# EAGLE design interro-cpu-board-r2 (EAGLE 5.12)
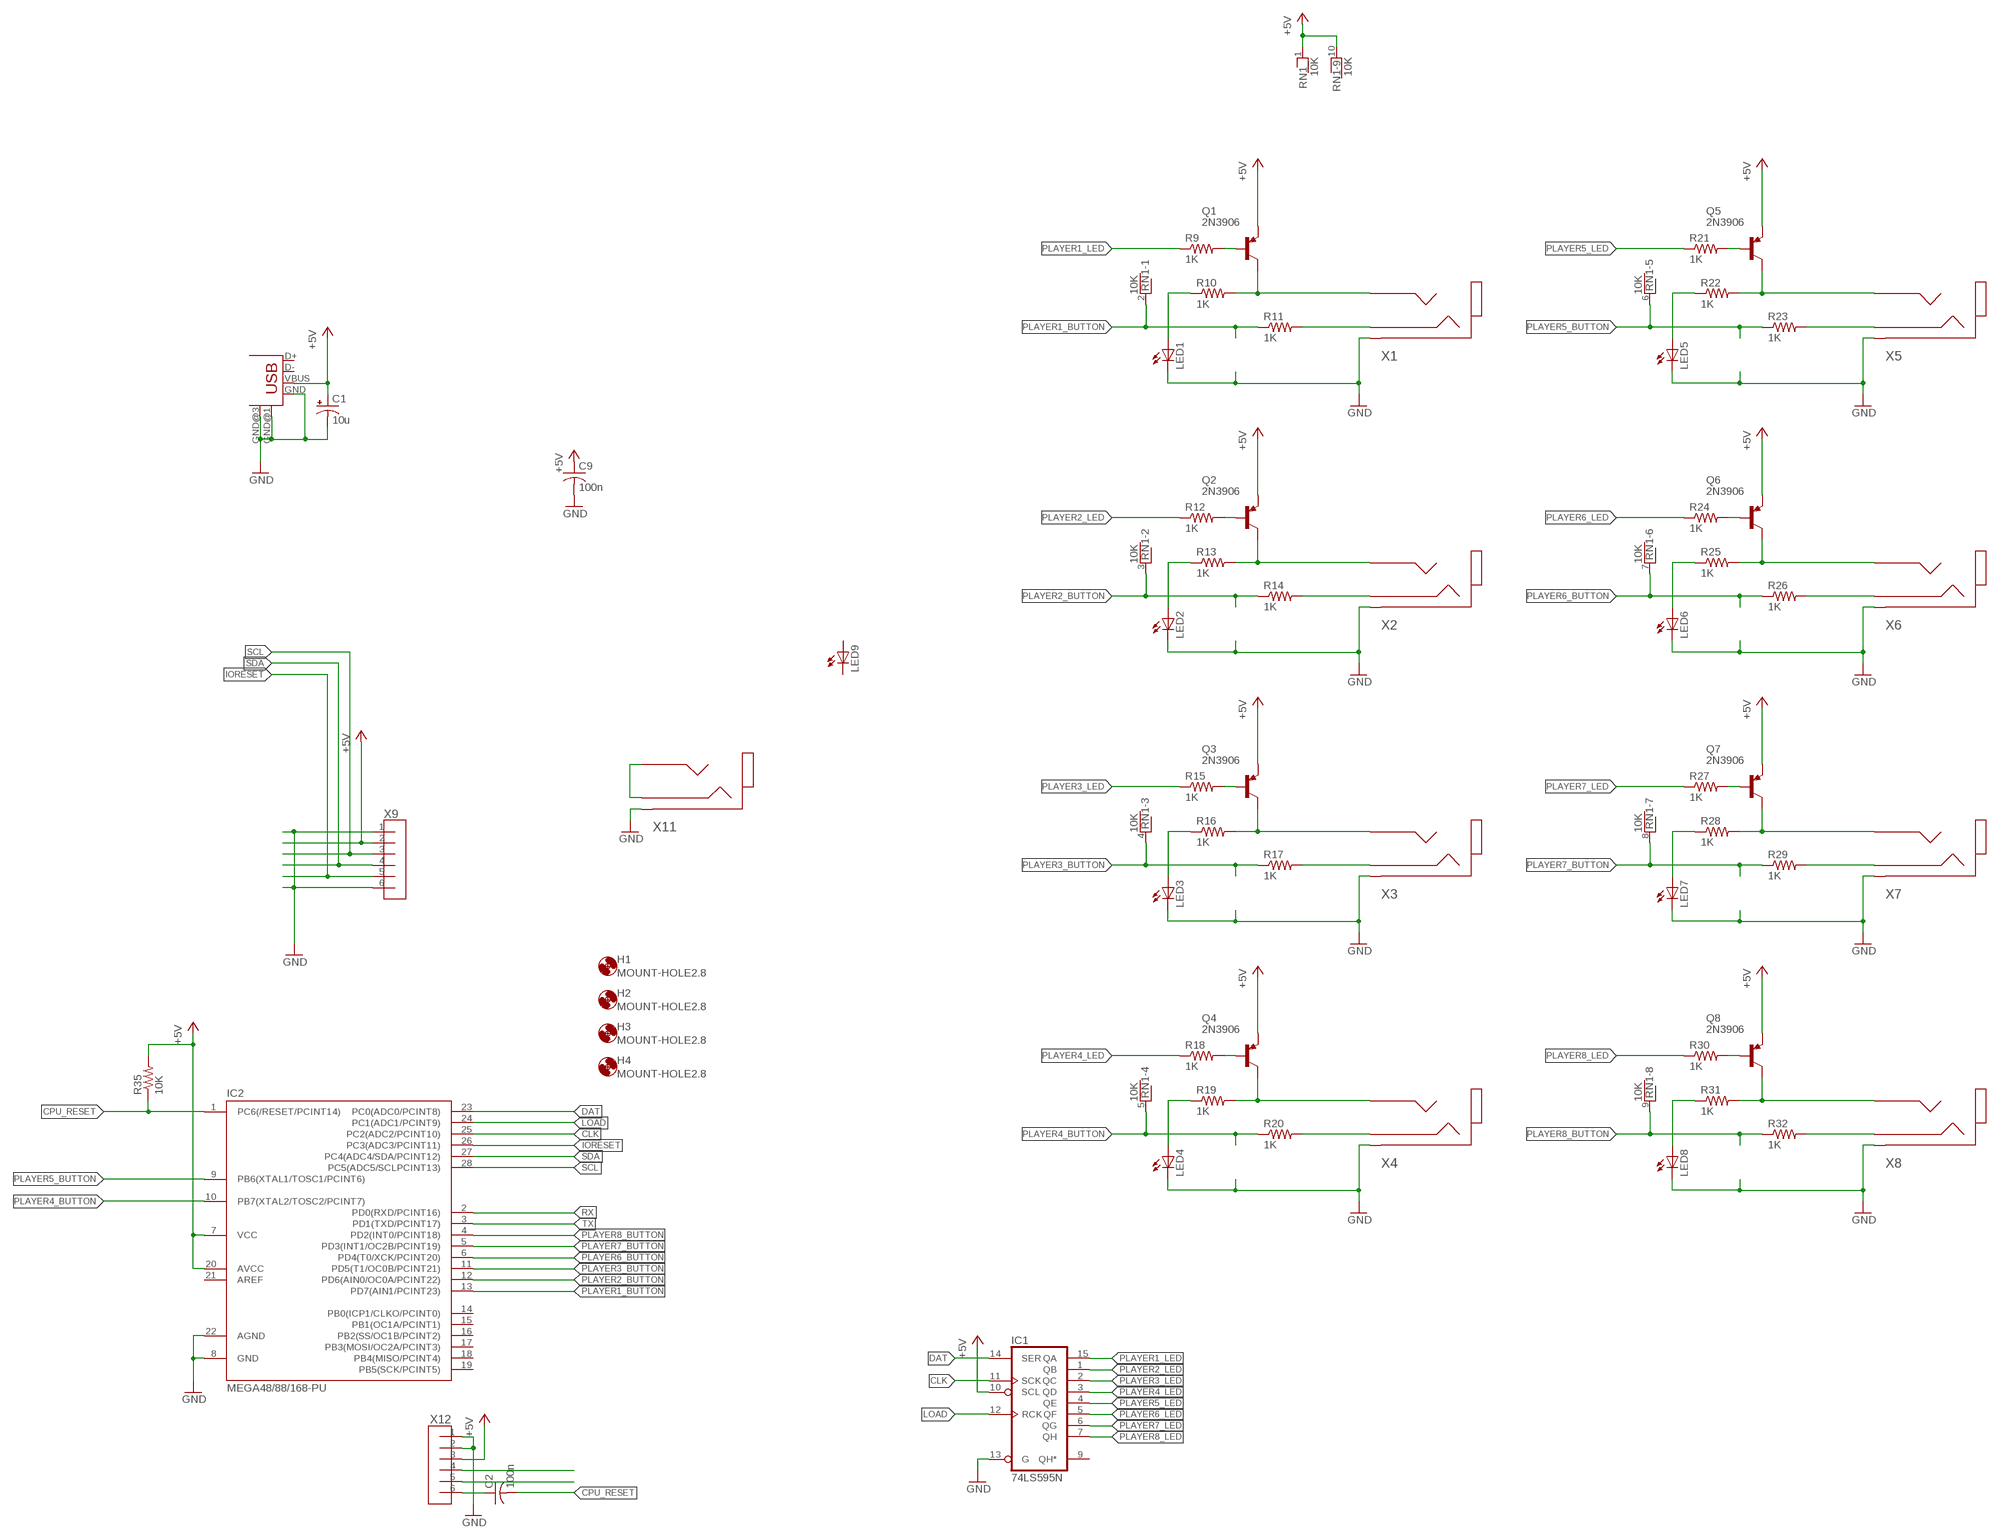
[diagram p0: schematic, sheet 1]

## Parts
C1  10u  CPOL-USE2-5  [E2-5]
C2  100n  C-US050-025X075  [C050-025X075]
C9  100n  C-US050-025X075  [C050-025X075]
H1  MOUNT-HOLE2.8  [2,8]
H2  MOUNT-HOLE2.8  [2,8]
H3  MOUNT-HOLE2.8  [2,8]
H4  MOUNT-HOLE2.8  [2,8]
IC1  74LS595N  [DIL16]
IC2  MEGA48/88/168-PU  [DIL28-3]
LED1  LED3MM  [LED3MM]
LED2  LED3MM  [LED3MM]
LED3  LED3MM  [LED3MM]
LED4  LED3MM  [LED3MM]
LED5  LED3MM  [LED3MM]
LED6  LED3MM  [LED3MM]
LED7  LED3MM  [LED3MM]
LED8  LED3MM  [LED3MM]
LED9  LED3MM  [LED3MM]
Q1  2N3906  [TO92]
Q2  2N3906  [TO92]
Q3  2N3906  [TO92]
Q4  2N3906  [TO92]
Q5  2N3906  [TO92]
Q6  2N3906  [TO92]
Q7  2N3906  [TO92]
Q8  2N3906  [TO92]
R9  1K  R-US_0207/7  [0207/7]
R10  1K  R-US_0207/7  [0207/7]
R11  1K  R-US_0207/7  [0207/7]
R12  1K  R-US_0207/7  [0207/7]
R13  1K  R-US_0207/7  [0207/7]
R14  1K  R-US_0207/7  [0207/7]
R15  1K  R-US_0207/7  [0207/7]
R16  1K  R-US_0207/7  [0207/7]
R17  1K  R-US_0207/7  [0207/7]
R18  1K  R-US_0207/7  [0207/7]
R19  1K  R-US_0207/7  [0207/7]
R20  1K  R-US_0207/7  [0207/7]
R21  1K  R-US_0207/7  [0207/7]
R22  1K  R-US_0207/7  [0207/7]
R23  1K  R-US_0207/7  [0207/7]
R24  1K  R-US_0207/7  [0207/7]
R25  1K  R-US_0207/7  [0207/7]
R26  1K  R-US_0207/7  [0207/7]
R27  1K  R-US_0207/7  [0207/7]
R28  1K  R-US_0207/7  [0207/7]
R29  1K  R-US_0207/7  [0207/7]
R30  1K  R-US_0207/7  [0207/7]
R31  1K  R-US_0207/7  [0207/7]
R32  1K  R-US_0207/7  [0207/7]
R35  10K  R-US_0207/7  [0207/7]
RN1  10K  RNX9  [RN-10]
X1  SJ1-3533N  [SJ1-3533N]
X2  SJ1-3533N  [SJ1-3533N]
X3  SJ1-3533N  [SJ1-3533N]
X4  SJ1-3533N  [SJ1-3533N]
X5  SJ1-3533N  [SJ1-3533N]
X6  SJ1-3533N  [SJ1-3533N]
X7  SJ1-3533N  [SJ1-3533N]
X8  SJ1-3533N  [SJ1-3533N]
X9  M06-100MIL  [100MIL-6]
X10  USB-RAYMOND  [USB-MB-RAYMOND]
X11  SJ1-3533N  [SJ1-3533N]
X12  M06-100MIL  [100MIL-6]

## Nets
+5V: C1.+ C9.1 IC1.10(SCL) IC2.7(VCC) IC2.20(AVCC) Q1.3(E) Q2.3(E) Q3.3(E) Q4.3(E) Q5.3(E) Q6.3(E) Q7.3(E) Q8.3(E) R35.2 RN1.1 RN1.10 X9.2 X10.VBUS X12.3
CLK: IC1.11(SCK) IC2.25(PC2(ADC2/PCINT10))
CPU_RESET: C2.2 IC2.1(PC6(/RESET/PCINT14)) R35.1
DAT: IC1.14(SER) IC2.23(PC0(ADC0/PCINT8))
GND: C1.- C9.2 IC1.13(G) IC2.8(GND) IC2.22(AGND) LED1.K(C) LED2.K(C) LED3.K(C) LED4.K(C) LED5.K(C) LED6.K(C) LED7.K(C) LED8.K(C) X1.SHIELD(SLEEVE) X2.SHIELD(SLEEVE) X3.SHIELD(SLEEVE) X4.SHIELD(SLEEVE) X5.SHIELD(SLEEVE) X6.SHIELD(SLEEVE) X7.SHIELD(SLEEVE) X8.SHIELD(SLEEVE) X9.1 X9.6 X10.GND X10.GND@1(GND) X10.GND@3(GND) X11.SHIELD(SLEEVE) X12.1 X12.2
IORESET: IC2.26(PC3(ADC3/PCINT11)) X9.5
LOAD: IC1.12(RCK) IC2.24(PC1(ADC1/PCINT9))
N$2: X11.RING X11.TIP
N$5: C2.1 X12.6
N$9: R11.2 X1.RING
N$10: Q1.1(C) R10.2 X1.TIP
N$12: Q1.2(B) R9.2
N$13: LED1.A R10.1
N$14: R14.2 X2.RING
N$15: Q2.1(C) R13.2 X2.TIP
N$16: Q2.2(B) R12.2
N$17: LED2.A R13.1
N$18: R17.2 X3.RING
N$19: Q3.1(C) R16.2 X3.TIP
N$20: Q3.2(B) R15.2
N$21: LED3.A R16.1
N$22: R20.2 X4.RING
N$23: Q4.1(C) R19.2 X4.TIP
N$24: Q4.2(B) R18.2
N$25: LED4.A R19.1
N$26: R23.2 X5.RING
N$27: Q5.1(C) R22.2 X5.TIP
N$28: Q5.2(B) R21.2
N$29: LED5.A R22.1
N$30: R26.2 X6.RING
N$31: Q6.1(C) R25.2 X6.TIP
N$32: Q6.2(B) R24.2
N$33: LED6.A R25.1
N$34: R29.2 X7.RING
N$35: Q7.1(C) R28.2 X7.TIP
N$36: Q7.2(B) R27.2
N$37: LED7.A R28.1
N$38: R32.2 X8.RING
N$39: Q8.1(C) R31.2 X8.TIP
N$40: Q8.2(B) R30.2
N$41: LED8.A R31.1
PLAYER1_BUTTON: IC2.13(PD7(AIN1/PCINT23)) R11.1 RN1.2
PLAYER1_LED: IC1.15(QA) R9.1
PLAYER2_BUTTON: IC2.12(PD6(AIN0/OC0A/PCINT22)) R14.1 RN1.3
PLAYER2_LED: IC1.1(QB) R12.1
PLAYER3_BUTTON: IC2.11(PD5(T1/OC0B/PCINT21)) R17.1 RN1.4
PLAYER3_LED: IC1.2(QC) R15.1
PLAYER4_BUTTON: IC2.10(PB7(XTAL2/TOSC2/PCINT7)) R20.1 RN1.5
PLAYER4_LED: IC1.3(QD) R18.1
PLAYER5_BUTTON: IC2.9(PB6(XTAL1/TOSC1/PCINT6)) R23.1 RN1.6
PLAYER5_LED: IC1.4(QE) R21.1
PLAYER6_BUTTON: IC2.6(PD4(T0/XCK/PCINT20)) R26.1 RN1.7
PLAYER6_LED: IC1.5(QF) R24.1
PLAYER7_BUTTON: IC2.5(PD3(INT1/OC2B/PCINT19)) R29.1 RN1.8
PLAYER7_LED: IC1.6(QG) R27.1
PLAYER8_BUTTON: IC2.4(PD2(INT0/PCINT18)) R32.1 RN1.9
PLAYER8_LED: IC1.7(QH) R30.1
RX: IC2.2(PD0(RXD/PCINT16)) X12.4
SCL: IC2.28(PC5(ADC5/SCLPCINT13)) X9.3
SDA: IC2.27(PC4(ADC4/SDA/PCINT12)) X9.4
TX: IC2.3(PD1(TXD/PCINT17)) X12.5
Unconnected: IC1.9(QH*) IC2.14(PB0(ICP1/CLKO/PCINT0)) IC2.15(PB1(OC1A/PCINT1)) IC2.16(PB2(SS/OC1B/PCINT2)) IC2.17(PB3(MOSI/OC2A/PCINT3)) IC2.18(PB4(MISO/PCINT4)) IC2.19(PB5(SCK/PCINT5)) IC2.21(AREF) LED9.A LED9.K(C) X10.D+ X10.D-

## Power pins joined to a net without a drawn wire
GND: IC1.8(GND)
VCC: IC1.16(VCC)

## Library data of the parts
C1 = rcl:CPOL-US: POLARIZED CAPACITOR, American symbol
C2 C9 = rcl:C-US: CAPACITOR, American symbol
H1-H4 = holes:MOUNT-HOLE: MOUNTING HOLE with drill center marker
IC1 = 74xx-us:74*595: 8-bit SHIFT REGISTER, output latch
IC2 = avr-5:MEGA48/88/168-PU
LED1-LED9 = led:LED: LED OSRAM: - CHIPLED LG R971, LG N971, LY N971, LG Q971, LY Q971, LO R971, LY R971 LH N974, LH R974 LS Q976, LO Q976, LY Q976 LO Q996 - Hyper CHIPLED LW Q18S LB Q993, LB Q99A, LB R99A - SideLED LS A670, LO A670, LY A670, LG A670, LP A670 LB A673, LV A673, LT A673, LW A673 LH A674 LY A675 LS A676, LA A676, LO A676, LY A676, LW A676 LS A679, LY A679, LG A679 - Hyper Micro SIDELED® LS Y876, LA Y876, LO Y876, LY Y876 LT Y87S - SmartLED LW L88C, LW L88S LB L89C, LB L89S, LG L890 LS L89K, LO L89K, LY L89K LS L896, LA L896, LO L896, LY L896 - TOPLED LS T670, LO T670, LY T670, LG T670, LP T670 LSG T670, LSP T670, LSY T670, LOP T670, LYG T670 LG T671, LOG T671, LSG T671 LB T673, LV T673, LT T673, LW T673 LH T674 LS T676, LA T676, LO T676, LY T676, LB T676, LH T676, LSB T676, LW T676 LB T67C, LV T67C, LT T67C, LS T67K, LO T67K, LY T67K, LW E67C LS E67B, LA E67B, LO E67B, LY E67B, LB E67C, LV E67C, LT E67C LW T67C LS T679, LY T679, LG T679 LS T770, LO T770, LY T770, LG T770, LP T770 LB T773, LV T773, LT T773, LW T773 LH T774 LS E675, LA E675, LY E675, LS T675 LS T776, LA T776, LO T776, LY T776, LB T776 LHGB T686 LT T68C, LB T68C - Hyper Mini TOPLED® LB M676 - Mini TOPLED Santana® LG M470 LS M47K, LO M47K, LY M47K Source: http://www.osram.convergy.de LUXEON: - LUMILED® LXK2-PW12-R00, LXK2-PW12-S00, LXK2-PW14-U00, LXK2-PW14-V00 LXK2-PM12-R00, LXK2-PM12-S00, LXK2-PM14-U00 LXK2-PE12-Q00, LXK2-PE12-R00, LXK2-PE12-S00, LXK2-PE14-T00, LXK2-PE14-U00 LXK2-PB12-K00, LXK2-PB12-L00, LXK2-PB12-M00, LXK2-PB14-N00, LXK2-PB14-P00, LXK2-PB14-Q00 LXK2-PR12-L00, LXK2-PR12-M00, LXK2-PR14-Q00, LXK2-PR14-R00 LXK2-PD12-Q00, LXK2-PD12-R00, LXK2-PD12-S00 LXK2-PH12-R00, LXK2-PH12-S00 LXK2-PL12-P00, LXK2-PL12-Q00, LXK2-PL12-R00 Source: www.luxeon.com KINGBRIGHT: KA-3528ASYC Source: www.kingbright.com
Q1-Q8 = transistor-pnp:2N3906: PNP Transistor
R9-R32 R35 = rcl:R-US_: RESISTOR, American symbol
RN1 = resistor-net:RNX9: RESISTOR NETWORK; OC_FARNELL: unknown; OC_NEWARK: unknown
X1-X8 X11 = rbg-cui-audio:SJ1-3533N
X9 X12 = rbg-generic-headers:M06-100MIL
X10 = con-usb-2:USB: USB Connectors

## Board
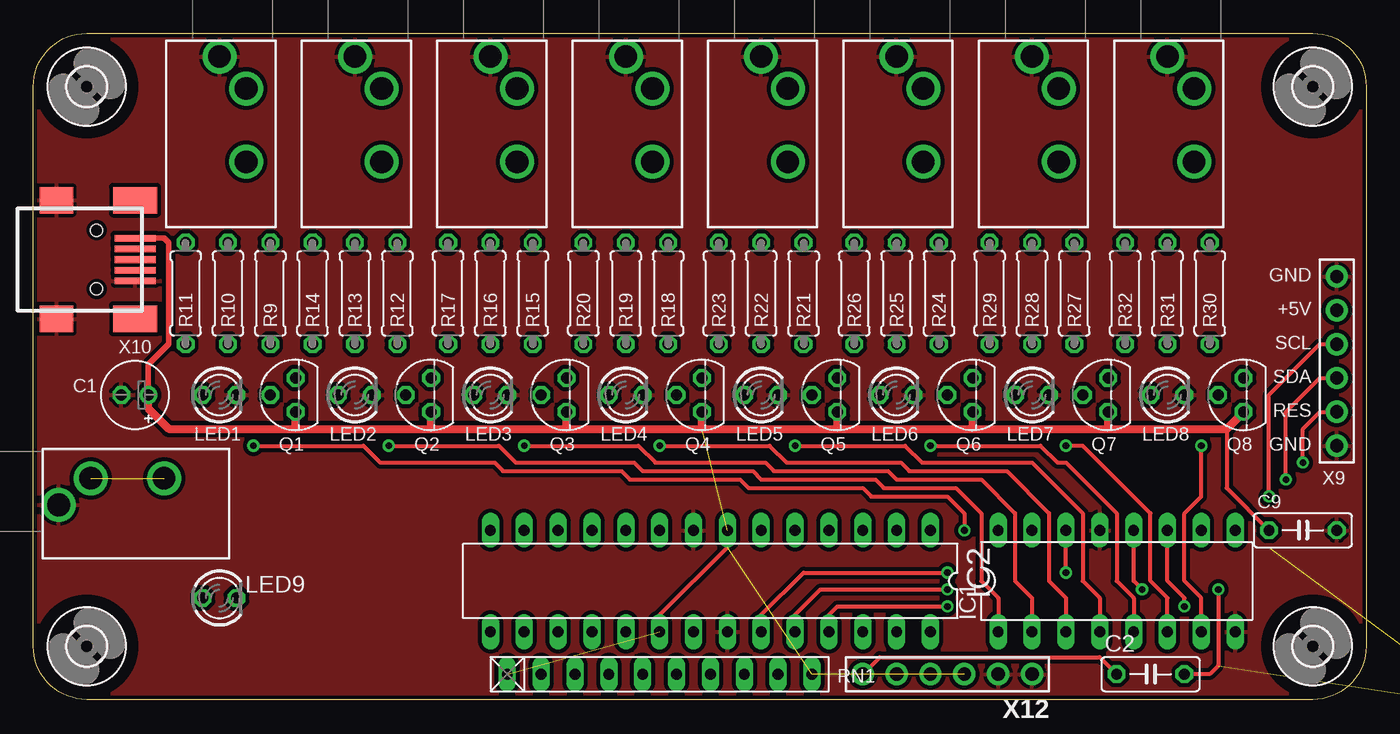
[diagram p1: board, top side]
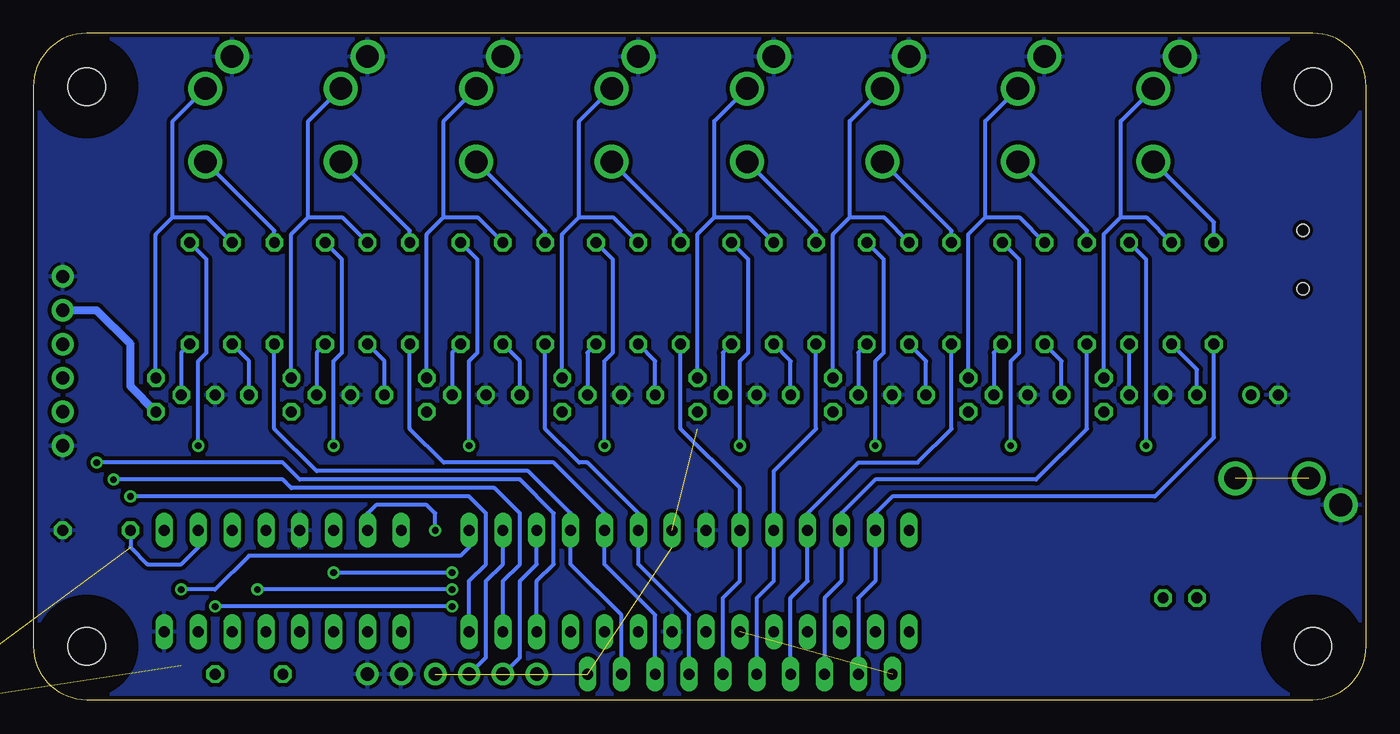
[diagram p2: board, bottom side, seen from below]

Size 100 x 50 mm. Coordinates in mm from the lower left corner, seen from the top.
Outline: 0,46 arc-90 4,50 96,50 arc-90 100,46 100,4 arc-90 96,0 4,0 arc-90 0,4 0,46
Copper layers (1*16): Top 0.035mm / dielectric 1.5mm / Bottom 0.035mm
Design rules "default *": minimum track width 10mil, minimum drill 19mil, track to track 10mil, track to pad 10mil, pad to pad 10mil, via to via 10mil, smd to smd 10mil, copper to edge 10mil, drill to drill 8mil, minimum pad ring 10mil, minimum via ring 8mil, stop-mask expansion 4mil, vias tented up to drill 20mil, thermal gap 10mil

### Footprints (pad centres in the part's own frame; a part is rotated, then mirrored left to right if it is on the bottom)
E2-5 = drill 0.813 pad 1.27 round: + -1.016,0 | drill 0.813 pad 1.27 octagon: - 1.016,0
C050-025X075 = drill 0.813 octagon: 1 -2.54,0; 2 2.54,0
2,8 = hole 2.8: 0,0
DIL16 = drill 0.813 long: 1 -8.89,-3.81; 2 -6.35,-3.81; 3 -3.81,-3.81; 4 -1.27,-3.81; 5 1.27,-3.81; 6 3.81,-3.81; 7 6.35,-3.81; 8 8.89,-3.81; 9 8.89,3.81; 10 6.35,3.81; 11 3.81,3.81; 12 1.27,3.81; 13 -1.27,3.81; 14 -3.81,3.81; 15 -6.35,3.81; 16 -8.89,3.81
DIL28-3 = drill 0.813 long: 1 -16.51,-3.81; 2 -13.97,-3.81; 3 -11.43,-3.81; 4 -8.89,-3.81; 5 -6.35,-3.81; 6 -3.81,-3.81; 7 -1.27,-3.81; 8 1.27,-3.81; 9 3.81,-3.81; 10 6.35,-3.81; 11 8.89,-3.81; 12 11.43,-3.81; 13 13.97,-3.81; 14 16.51,-3.81; 15 16.51,3.81; 16 13.97,3.81; 17 11.43,3.81; 18 8.89,3.81; 19 6.35,3.81; 20 3.81,3.81; 21 1.27,3.81; 22 -1.27,3.81; 23 -3.81,3.81; 24 -6.35,3.81; 25 -8.89,3.81; 26 -11.43,3.81; 27 -13.97,3.81; 28 -16.51,3.81
LED3MM = drill 0.813 octagon: A -1.27,0; K 1.27,0
TO92 = drill 0.813 octagon: 1 1.27,0; 2 0,1.905; 3 -1.27,0
0207/7 = drill 0.813 octagon: 1 -3.81,0; 2 3.81,0
RN-10 = drill 0.813 long: 1 -11.43,0; 2 -8.89,0; 3 -6.35,0; 4 -3.81,0; 5 -1.27,0; 6 1.27,0; 7 3.81,0; 8 6.35,0; 9 8.89,0; 10 11.43,0
SJ1-3533N = drill 1.7 round: RING 7.9,2; SHIELD 0,0; TIP 2.4,2
100MIL-6 = drill 1 pad 1.676 round: 1 -6.35,0; 2 -3.81,0; 3 -1.27,0; 4 1.27,0; 5 3.81,0; 6 6.35,0
USB-MB-RAYMOND = smd 0.5 x 3.1: D+ 0,4.15; D- -0.8,4.15; GND 1.6,4.15; ID 0.8,4.15; VBUS -1.6,4.15 | smd 2 x 2.5: GND@1 -4.45,-1.75; GND@3 4.45,-1.75 | smd 2 x 3.3: GND@2 -4.45,4.15; GND@4 4.45,4.15 | hole 0.9: -2.2,1.25; 2.2,1.25

### Placement (x,y rotation side)
C1  7.62,22.86 180 top
C2  83.82,1.91 0 top
C9  95.25,12.7 0 top
H1  4,4 0 top
H2  4,46 0 top
H3  96,46 0 top
H4  96,4 0 top
IC1  81.28,8.89 0 top
IC2  50.8,8.89 180 top
LED1  13.97,22.86 0 top
LED2  24.13,22.86 0 top
LED3  34.29,22.86 0 top
LED4  44.45,22.86 0 top
LED5  54.61,22.86 0 top
LED6  64.77,22.86 0 top
LED7  74.93,22.86 0 top
LED8  85.09,22.86 0 top
LED9  13.97,7.62 0 top
Q1  19.68,22.86 90 top
Q2  29.84,22.86 90 top
Q3  40.01,22.86 90 top
Q4  50.16,22.86 90 top
Q5  60.33,22.86 90 top
Q6  70.48,22.86 90 top
Q7  80.64,22.86 90 top
Q8  90.81,22.86 90 top
R9  17.78,30.48 270 top
R10  14.61,30.48 90 top
R11  11.43,30.48 90 top
R12  27.3,30.48 270 top
R13  24.13,30.48 90 top
R14  20.95,30.48 90 top
R15  37.47,30.48 270 top
R16  34.29,30.48 90 top
R17  31.11,30.48 90 top
R18  47.62,30.48 270 top
R19  44.45,30.48 90 top
R20  41.27,30.48 90 top
R21  57.78,30.48 270 top
R22  54.61,30.48 90 top
R23  51.44,30.48 90 top
R24  67.94,30.48 270 top
R25  64.77,30.48 90 top
R26  61.59,30.48 90 top
R27  78.11,30.48 270 top
R28  74.93,30.48 90 top
R29  71.75,30.48 90 top
R30  88.27,30.48 270 top
R31  85.09,30.48 90 top
R32  81.92,30.48 90 top
R35  121.92,-6.35 270 top  (outside the outline)
RN1  46.99,1.91 0 top
X1  13.97,48.26 270 top
X2  24.13,48.26 270 top
X3  34.29,48.26 270 top
X4  44.45,48.26 270 top
X5  54.61,48.26 270 top
X6  64.77,48.26 270 top
X7  74.93,48.26 270 top
X8  85.09,48.26 270 top
X9  97.79,25.4 270 top
X10  3.49,33.02 270 top
X11  1.91,14.61 0 top
X12  68.58,1.91 180 top

### Tracks (layer width: path | path; a pad name or v marks a point on that pad's centre or on a via)
+5V  (5 unrouted)
  Top 0.305: IC2.20 46.99,6.35 52.07,11.43 IC2.7 | 89.53,20.32 89.53,15.88 C9.1
  Top 0.406: X10.VBUS 9.83,34.62 10.16,34.29 10.16,26.67 8.64,25.15 C1.+
  Top 0.61: 19.68,20.32 29.84,20.32 | 29.84,20.32 40.01,20.32 | 40.01,20.32 50.16,20.32 | 50.16,20.32 60.33,20.32 | 60.33,20.32 70.48,20.32 | 70.48,20.32 80.64,20.32 | 19.68,20.32 Q1.3 | 29.84,20.32 Q2.3 | 40.01,20.32 Q3.3 | 80.64,20.32 Q7.3 | 70.48,20.32 Q6.3 | 60.33,20.32 Q5.3 | 50.16,20.32 Q4.3 | 80.64,20.32 89.53,20.32 Q8.3 | C1.+ 8.64,21.84 10.16,20.32 19.68,20.32
  Bottom 0.305: C9.1 92.71,11.43 91.44,10.16 88.9,10.16 87.63,11.43 IC1.10
  Bottom 0.61: Q8.3 92.71,23.5 92.71,26.67 95.25,29.21 X9.2
CLK  (via drill 0.5)
  Top 0.305: IC1.11 85.09,8.89 86.36,7.62 v86.36,6.99 | v68.58,6.99 60.33,6.99 59.69,6.35 IC2.25
  Bottom 0.305: v68.58,6.99 v86.36,6.99
CPU_RESET  (via drill 0.5)  (1 unrouted)
  Top 0.305: C2.2 88.27,1.91 88.9,2.54 v88.9,8.26
  Bottom 0.305: v88.9,8.26 86.36,8.26 83.82,10.79 67.94,10.79 67.31,11.43 IC2.1
DAT  (via drill 0.5)
  Top 0.305: v77.47,9.53 IC1.14 | v68.58,9.53 57.78,9.53 54.61,6.35 IC2.23
  Bottom 0.305: v68.58,9.53 v77.47,9.53
GND
  pour Bottom (isolate 0.305): -1.27,50.8 100.33,50.8 100.33,0 100.33,-1.27 -1.27,-1.27
  pour Top (isolate 0.305): -1.27,50.8 100.33,50.8 100.33,0 100.33,-1.27 -1.27,-1.27
IORESET  (via drill 0.5)
  Top 0.305: v95.25,17.78 95.25,20.32 96.52,21.59 X9.5
  Bottom 0.305: IC2.26 62.23,8.89 60.96,10.16 60.96,13.97 63.5,16.51 80.01,16.51 81.28,17.78 v95.25,17.78
LOAD  (via drill 0.5)
  Top 0.305: v83.19,8.26 82.55,8.89 IC1.12 | v68.58,8.26 59.05,8.26 57.15,6.35 IC2.24
  Bottom 0.305: v68.58,8.26 v83.19,8.26
N$2  (1 unrouted)
N$5
  Top 0.305: C2.1 80.01,3.17 63.5,3.17 X12.6
N$9
  Bottom 0.305: R11.2 11.43,35.82 X1.RING
N$10
  Bottom 0.305: Q1.1 19.68,34.92 18.41,36.2 | 18.41,36.2 18.41,43.41 X1.TIP | 18.41,36.2 16.51,36.2 R10.2
N$12
  Bottom 0.305: Q1.2 R9.2
N$13
  Bottom 0.305: LED1.A 12.7,24.77 R10.1
N$14
  Bottom 0.305: R14.2 20.95,35.19 X2.RING
N$15
  Bottom 0.305: Q2.1 29.84,34.92 28.57,36.2 | 28.57,36.2 28.57,43.41 X2.TIP | 28.57,36.2 26.04,36.2 R13.2
N$16
  Bottom 0.305: Q2.2 27.94,26.04 R12.2
N$17
  Bottom 0.305: LED2.A 22.86,25.4 R13.1
N$18
  Bottom 0.305: R17.2 31.11,35.19 X3.RING
N$19
  Bottom 0.305: Q3.1 40.01,34.92 38.73,36.2 | 38.73,36.2 38.73,43.41 X3.TIP | R16.2 36.2,36.2 38.73,36.2
N$20
  Bottom 0.305: Q3.2 38.1,26.04 R15.2
N$21
  Bottom 0.305: LED3.A 33.02,25.4 R16.1
N$22
  Bottom 0.305: R20.2 41.27,35.19 X4.RING
N$23
  Bottom 0.305: Q4.1 50.16,34.92 48.9,36.2 | 48.9,36.2 46.35,36.2 R19.2 | 48.9,36.2 48.9,43.41 X4.TIP
N$24
  Bottom 0.305: Q4.2 48.26,26.04 R18.2
N$25
  Bottom 0.305: LED4.A 43.18,25.4 R19.1
N$26
  Bottom 0.305: R23.2 51.44,35.19 X5.RING
N$27
  Bottom 0.305: Q5.1 60.33,34.92 59.05,36.2 | R22.2 56.52,36.2 59.05,36.2 | 59.05,36.2 59.05,43.41 X5.TIP
N$28
  Bottom 0.305: Q5.2 58.42,26.04 R21.2
N$29
  Bottom 0.305: LED5.A 53.34,25.4 R22.1
N$30
  Bottom 0.305: R26.2 61.59,35.19 X6.RING
N$31
  Bottom 0.305: Q6.1 70.48,34.92 69.22,36.2 | R25.2 66.67,36.2 69.22,36.2 | 69.22,36.2 69.22,43.41 X6.TIP
N$32
  Bottom 0.305: Q6.2 68.58,26.04 R24.2
N$33
  Bottom 0.305: LED6.A 63.5,25.4 R25.1
N$34
  Bottom 0.305: R29.2 71.75,35.19 X7.RING
N$35
  Bottom 0.305: X7.TIP 79.38,43.41 79.38,36.2 | Q7.1 80.64,34.92 79.38,36.2 | 79.38,36.2 76.83,36.2 R28.2
N$36
  Bottom 0.305: Q7.2 78.74,26.04 R27.2
N$37
  Bottom 0.305: LED7.A 73.66,25.4 R28.1
N$38
  Bottom 0.305: R32.2 81.92,35.19 X8.RING
N$39
  Bottom 0.305: X8.TIP 89.53,43.41 89.53,36.2 | Q8.1 90.81,34.92 89.53,36.2 | 89.53,36.2 87,36.2 R31.2
N$40
  Bottom 0.305: Q8.2 88.9,26.04 R30.2
N$41
  Bottom 0.305: R31.1 83.82,25.4 LED8.A
PLAYER1_BUTTON
  Bottom 0.305: R11.1 11.43,19.68 15.88,15.24 35.56,15.24 36.83,13.97 IC2.13 36.83,8.89 38.1,7.62 RN1.2
PLAYER1_LED  (via drill 0.5)
  Top 0.305: v16.51,19.05 24.77,19.05 26.04,17.78 34.61,17.78 35.24,17.14 44.13,17.14 44.77,16.51 53.02,16.51 53.66,15.88 62.23,15.88 62.87,15.24 68.58,15.24 69.85,13.97 v69.85,12.7
  Bottom 0.305: R9.1 16.51,33.02 v16.51,19.05 | v69.85,12.7 69.85,13.97 70.48,14.61 74.3,14.61 74.93,13.97 IC1.15
PLAYER2_BUTTON
  Bottom 0.305: R14.1 20.95,20.32 24.77,16.51 36.83,16.51 39.37,13.97 IC2.12 39.37,8.89 40.64,7.62 RN1.3
PLAYER2_LED  (via drill 0.5)
  Top 0.305: IC1.1 72.39,7.62 71.12,8.89 71.12,13.97 69.22,15.88 63.82,15.88 63.18,16.51 54.61,16.51 53.98,17.14 45.72,17.14 45.09,17.78 36.2,17.78 34.92,19.05 v26.67,19.05
  Bottom 0.305: R12.1 26.04,33.02 26.04,26.04 26.67,25.4 v26.67,19.05
PLAYER3_BUTTON
  Bottom 0.305: R17.1 31.11,20.32 33.66,17.78 38.1,17.78 41.91,13.97 IC2.11 41.91,8.89 43.18,7.62 RN1.4
PLAYER3_LED  (via drill 0.5)
  Top 0.305: IC1.2 74.93,7.62 73.66,8.89 73.66,13.97 71.12,16.51 64.77,16.51 64.14,17.14 55.56,17.14 54.93,17.78 46.67,17.78 45.4,19.05 v36.83,19.05
  Bottom 0.305: R15.1 36.2,33.02 36.2,26.04 36.83,25.4 v36.83,19.05
PLAYER4_BUTTON
  Bottom 0.305: R20.1 41.27,20.32 44.45,17.14 IC2.10 44.45,8.89 45.72,7.62 RN1.5
PLAYER4_LED  (via drill 0.5)
  Top 0.305: v46.99,19.05 55.24,19.05 56.52,17.78 65.09,17.78 65.72,17.14 73.03,17.14 76.2,13.97 76.2,8.89 77.47,7.62 IC1.3
  Bottom 0.305: R18.1 46.35,33.02 46.35,26.04 46.99,25.4 v46.99,19.05
PLAYER5_BUTTON
  Bottom 0.305: R23.1 51.44,20.32 46.99,15.88 IC2.9 46.99,8.89 48.26,7.62 RN1.6
PLAYER5_LED  (via drill 0.5)
  Top 0.305: v57.15,19.05 65.41,19.05 66.67,17.78 74.93,17.78 78.74,13.97 78.74,8.89 80.01,7.62 IC1.4
  Bottom 0.305: R21.1 56.52,33.02 56.52,26.04 57.15,25.4 v57.15,19.05
PLAYER6_BUTTON
  Bottom 0.305: R26.1 61.59,20.32 59.05,17.78 58.42,17.78 54.61,13.97 IC2.6 54.61,10.16 50.8,6.35 RN1.7
PLAYER6_LED  (via drill 0.5)
  Top 0.305: v67.31,19.05 75.56,19.05 76.83,17.78 77.47,17.78 81.28,13.97 81.28,8.89 82.55,7.62 IC1.5
  Bottom 0.305: R24.1 66.67,33.02 66.67,26.04 67.31,25.4 v67.31,19.05
PLAYER7_BUTTON
  Bottom 0.305: R29.1 71.75,20.32 69.22,17.78 60.96,17.78 57.15,13.97 IC2.5 57.15,10.16 53.34,6.35 RN1.8
PLAYER7_LED  (via drill 0.5)
  Top 0.305: v77.47,19.05 78.74,19.05 83.82,13.97 83.82,8.89 85.09,7.62 IC1.6
  Bottom 0.305: R27.1 76.83,33.02 76.83,26.04 77.47,25.4 v77.47,19.05
PLAYER8_BUTTON
  Bottom 0.305: R32.1 81.92,20.32 78.74,17.14 62.87,17.14 59.69,13.97 IC2.4 59.69,10.16 55.88,6.35 RN1.9
PLAYER8_LED  (via drill 0.5)
  Top 0.305: v87.63,19.05 87.63,15.24 86.36,13.97 86.36,8.89 87.63,7.62 IC1.7
  Bottom 0.305: R30.1 87,33.02 87,26.04 87.63,25.4 v87.63,19.05
RX
  Bottom 0.305: IC2.2 64.77,10.16 66.04,8.89 66.04,3.17 X12.4
SCL  (via drill 0.5)
  Top 0.305: v92.71,15.24 92.71,22.86 96.52,26.67 X9.3
  Bottom 0.305: IC2.28 67.31,8.89 66.04,10.16 66.04,13.97 67.31,15.24 v92.71,15.24
SDA  (via drill 0.5)
  Top 0.305: v93.98,16.51 93.98,21.59 96.52,24.13 X9.4
  Bottom 0.305: IC2.27 64.77,8.89 63.5,10.16 63.5,13.97 65.41,15.88 80.64,15.88 81.28,16.51 v93.98,16.51
TX
  Bottom 0.305: IC2.3 62.23,10.16 63.5,8.89 63.5,3.17 X12.5

### Text on the board
tNames: GND | +5V | SCL | SDA | RES | GND